# Altium schematic sheet 04_EBI_MEMORY.SchDoc
size 420 x 297 mm
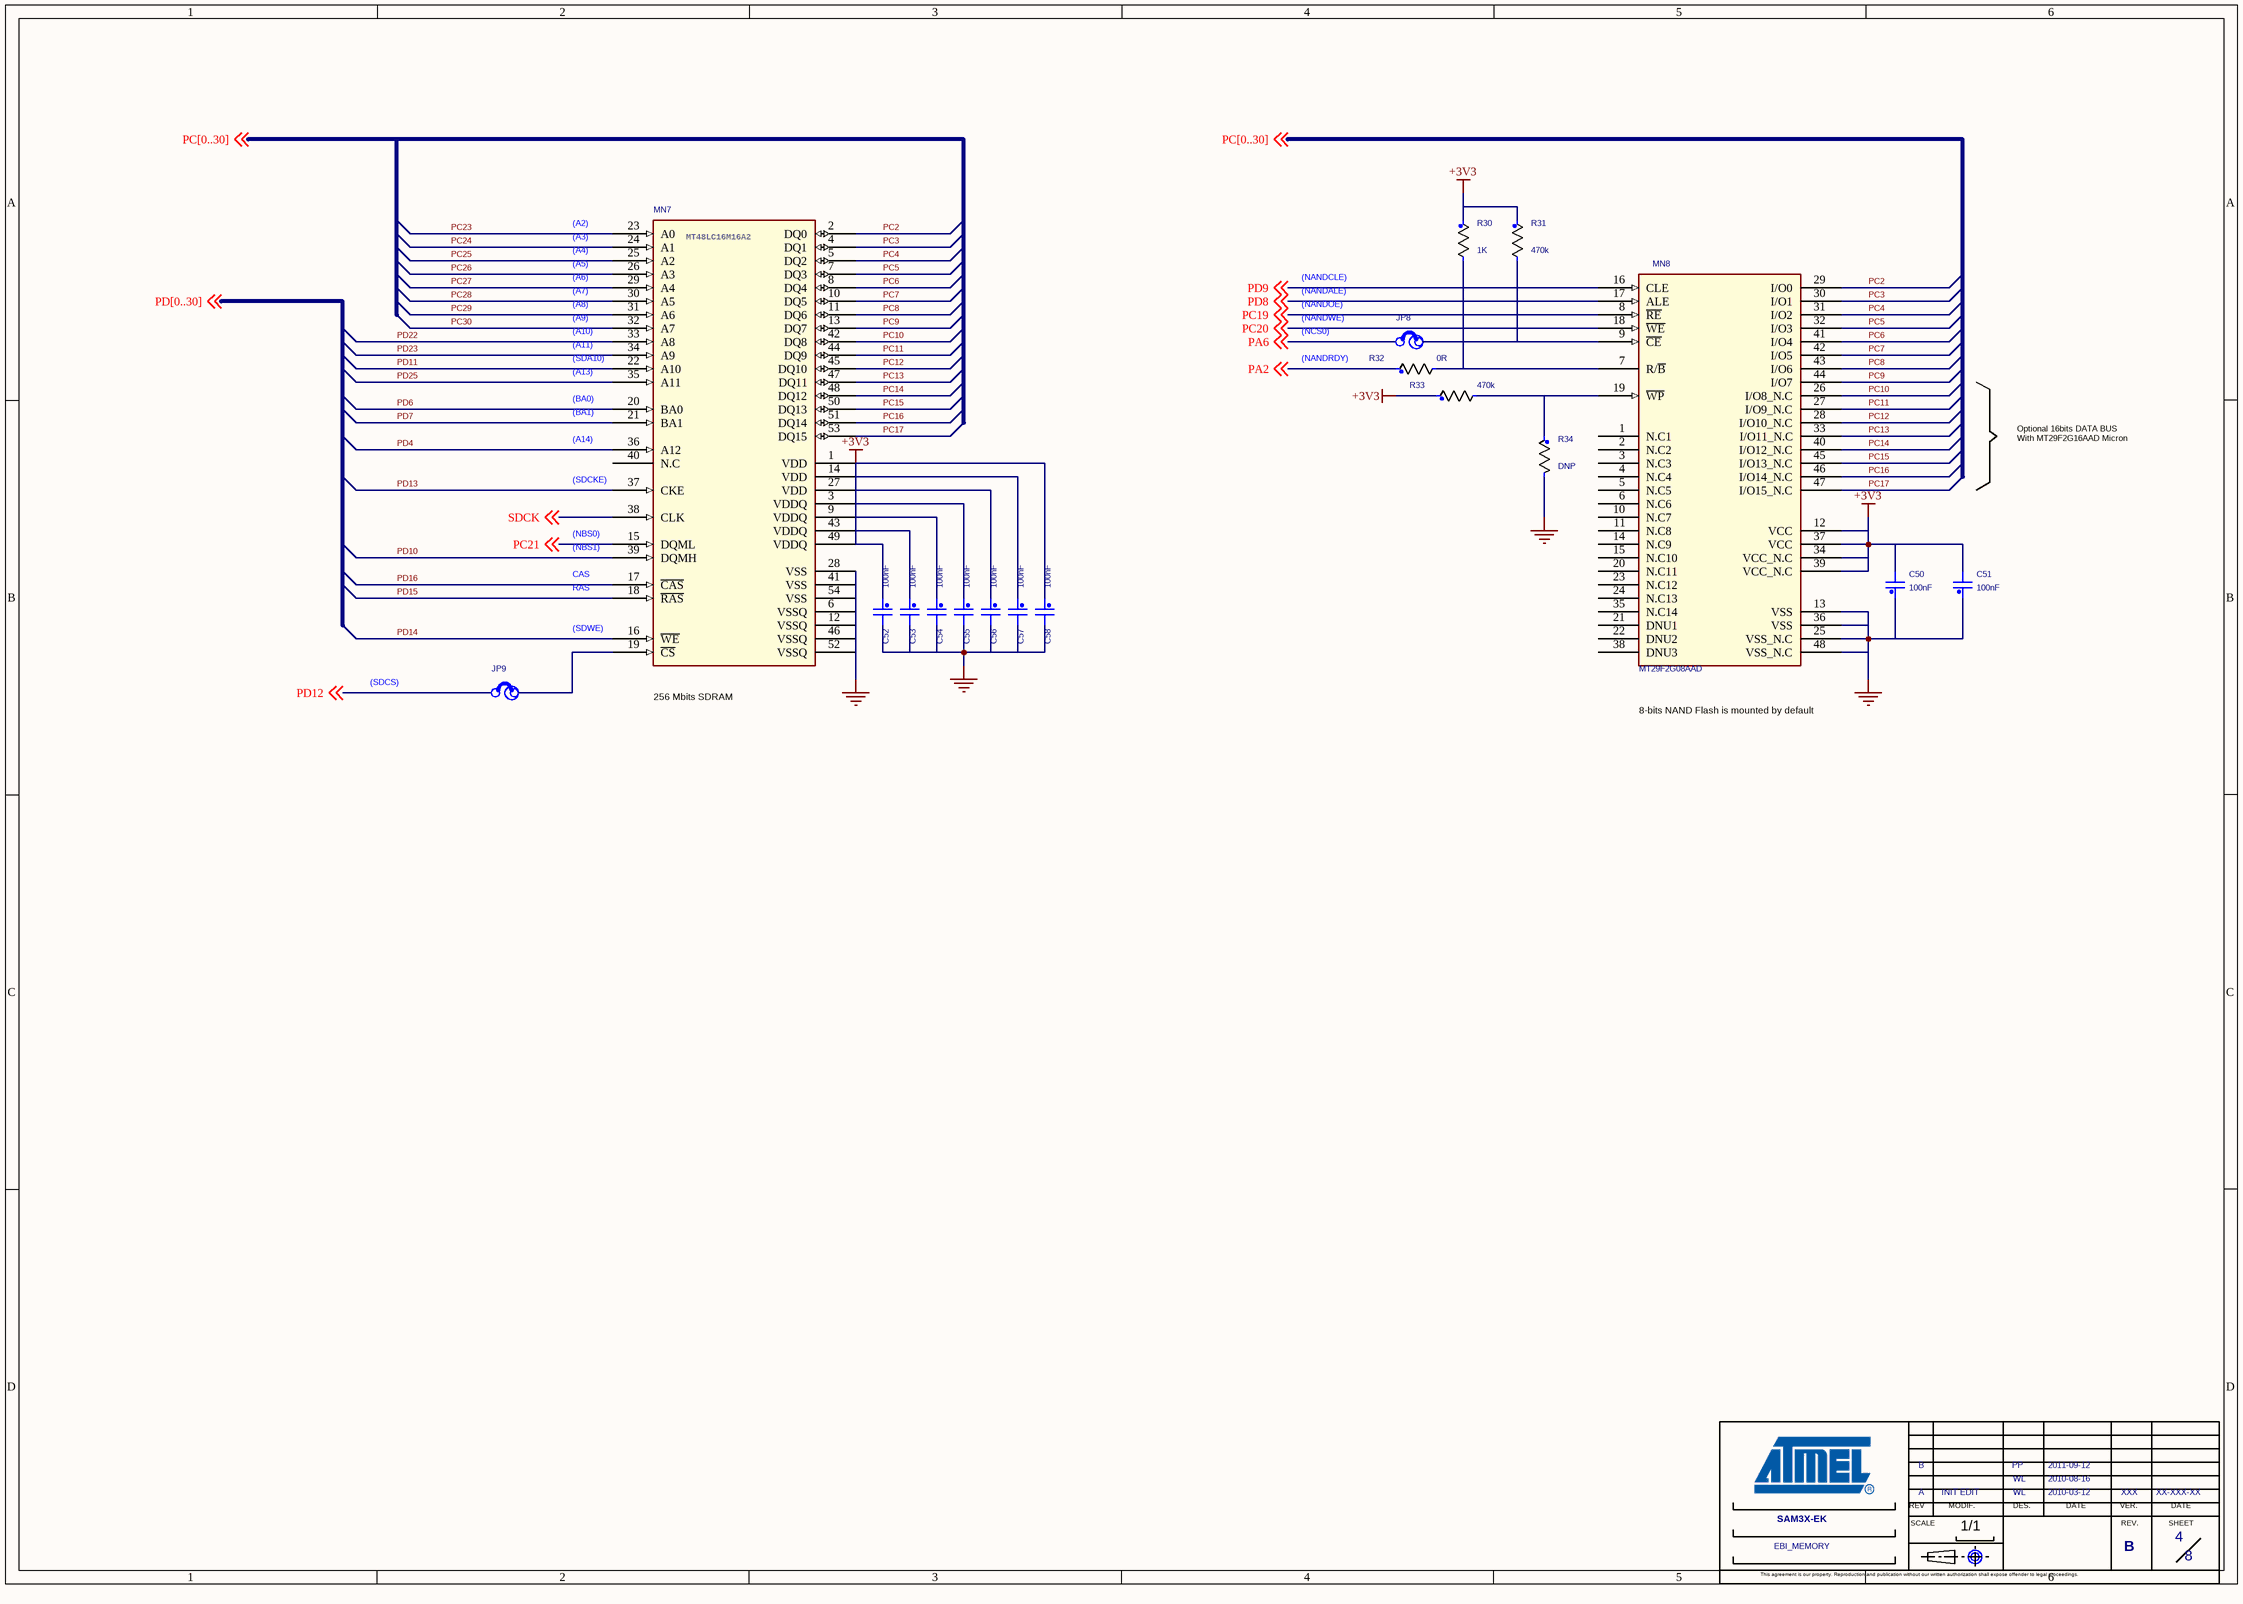
[diagram p0: 04_EBI_MEMORY.SchDoc]

## Parts
*  SHEET NAME 1: EBI_MEMORY  REV C: B  VERIF A: XXX  VERIF DATE A: XX-XXX-XX  Page Count: 8  Page Number: 4  DATE A: 2010-03-12  DATE B: 2010-08-16  DATE C: 2011-09-12  DES A: WL  DES C: PP  BOARD NAME: SAM3X-EK  VERSION: A  MODIF. DESCRIBE: INIT EDIT  (hidden comment: ATMEL ARM)  (graphical)
C50  100nF  [CAP0805]
C51  100nF  [CAP0805]
C52  100nF  [CAP0805]
C53  100nF  [CAP0805]
C54  100nF  [CAP0805]
C55  100nF  [CAP0805]
C56  100nF  [CAP0805]
C57  100nF  [CAP0805]
C58  100nF  [CAP0805]
JP8  JP  [BAR2PTS02]  (value not drawn)
JP9  JP  [BAR2PTS02]  (value not drawn)
MN7  MT48LC8M16A2TG-75  [TSOP54_01]  (value not drawn)
MN8  MT29F2G08AAD  [TSOP48]
R30  1K  [r0603]
R31  470k  [R0603]
R32  0R  [R0603]
R33  470k  [R0603]
R34  DNP  [R0603]
SH14  Jumper Pitch 2.54  [JUMPER-2.54]  (value not drawn)
SH15  Jumper Pitch 2.54  [JUMPER-2.54]  (value not drawn)

## Nets
+3V3: C50.2 C51.2 C52.1 C53.1 C54.1 C55.1 C56.1 C57.1 C58.1 MN7.1(VDD) MN7.3(VDDQ) MN7.9(VDDQ) MN7.14(VDD) MN7.27(VDD) MN7.43(VDDQ) MN7.49(VDDQ) MN8.12(VCC) MN8.34(VCC_N.C) MN8.37(VCC) MN8.39(VCC_N.C) R30.1 R31.1 R33.1
GND_POWER: C50.1 C51.1 C52.2 C53.2 C54.2 C55.2 C56.2 C57.2 C58.2 MN7.6(VSSQ) MN7.12(VSSQ) MN7.28(VSS) MN7.41(VSS) MN7.46(VSSQ) MN7.52(VSSQ) MN7.54(VSS) MN8.13(VSS) MN8.25(VSS_N.C) MN8.36(VSS) MN8.48(VSS_N.C) R34.2
PA2: R32.1 ; off-sheet PA2
PA6: JP8.2 ; off-sheet PA6
PC2: MN7.2(DQ0) MN8.29(I/O0)
PC3: MN7.4(DQ1) MN8.30(I/O1)
PC4: MN7.5(DQ2) MN8.31(I/O2)
PC5: MN7.7(DQ3) MN8.32(I/O3)
PC6: MN7.8(DQ4) MN8.41(I/O4)
PC7: MN7.10(DQ5) MN8.42(I/O5)
PC8: MN7.11(DQ6) MN8.43(I/O6)
PC9: MN7.13(DQ7) MN8.44(I/O7)
PC10: MN7.42(DQ8) MN8.26(I/O8_N.C)
PC11: MN7.44(DQ9) MN8.27(I/O9_N.C)
PC12: MN7.45(DQ10) MN8.28(I/O10_N.C)
PC13: MN7.47(DQ11) MN8.33(I/O11_N.C)
PC14: MN7.48(DQ12) MN8.40(I/O12_N.C)
PC15: MN7.50(DQ13) MN8.45(I/O13_N.C)
PC16: MN7.51(DQ14) MN8.46(I/O14_N.C)
PC17: MN7.53(DQ15) MN8.47(I/O15_N.C)
PC19: MN8.8(~{RE}) ; off-sheet PC19
PC20: MN8.18(~{WE}) ; off-sheet PC20
PC21: MN7.15(DQML) ; off-sheet PC21
PC23: MN7.23(A0)
PC24: MN7.24(A1)
PC25: MN7.25(A2)
PC26: MN7.26(A3)
PC27: MN7.29(A4)
PC28: MN7.30(A5)
PC29: MN7.31(A6)
PC30: MN7.32(A7)
PD4: MN7.36(A12)
PD6: MN7.20(BA0)
PD7: MN7.21(BA1)
PD8: MN8.17(ALE) ; off-sheet PD8
PD9: MN8.16(CLE) ; off-sheet PD9
PD10: MN7.39(DQMH)
PD11: MN7.22(A10)
PD12: JP9.2 ; off-sheet PD12
PD13: MN7.37(CKE)
PD14: MN7.16(~{WE})
PD15: MN7.18(~{RAS})
PD16: MN7.17(~{CAS})
PD22: MN7.33(A8)
PD23: MN7.34(A9)
PD25: MN7.35(A11)
SDCK: MN7.38(CLK) ; off-sheet SDCK
NetJP8_1: JP8.1 MN8.9(~{CE}) R31.2
NetJP9_1: JP9.1 MN7.19(~{CS})
NetMN8_7: MN8.7(R/~{B}) R30.2 R32.2
NetMN8_19: MN8.19(~{WP}) R33.2 R34.1

Not connected (* = marked no-connect by the designer): MN7 40(N.C); MN8 1(N.C1) 2(N.C2) 3(N.C3) 4(N.C4) 5(N.C5) 6(N.C6) 10(N.C7) 11(N.C8) 14(N.C9) 15(N.C10) 20(N.C11) 21(DNU1) 22(DNU2) 23(N.C12) 24(N.C13) 35(N.C14) 38(DNU3)

## Notes on the sheet
- (A2)
- (A3)
- (A4)
- (A5)
- (A6)
- (A7)
- (A8)
- (A9)
- (NANDALE)
- (NANDCLE)
- (NANDWE)
- (NANDOE)
- (near MN7) (SDA10)
- (A10)
- (A11)
- (A13)
- (NCS0)
- (NANDRDY)
- (A14)
- (BA0)
- (BA1)
- Optional 16bits DATA BUS
  With MT29F2G16AAD Micron
- (near MN7) (SDCKE)
- (NBS0)
- (NBS1)
- CAS
- RAS
- (SDWE)
- (SDCS)
- (near MN7) 256 Mbits SDRAM
- 8-bits NAND Flash is mounted by default
- (in symbol ATMEL ARM) REV; MODIF.; DES.; DATE; VER.; SCALE; REV.; SHEET; 1/1; This agreement is our property. Reproduction and publication without our written authorization shall expose offender to legal proceedings.
- (in symbol MT48LC16M16A2TG) MT48LC16M16A2

## Library data of the parts
* = ATMEL ARM: REV D: D; REV F: F; REV E: E; REV B: B; VERIF F: XXX; VERIF E: XXX; VERIF D: XXX; VERIF C: XXX; VERIF B: XXX; VERIF DATE F: XX-XXX-XX; VERIF DATE E: XX-XXX-XX; VERIF DATE D: XX-XXX-XX; VERIF DATE C: XX-XXX-XX; REV: B; VERIF DATE B: XX-XXX-XX; FT: ?; Page Size: A; Page Create Date: june 19, 2004; DATE D: XX-XXX-XX; DATE E: XX-XXX-XX; DATE F: XX-XXX-XX; DES E: XXX; DES F: XXX; DES B: WL; DES D: XXX
C50 C51 = C_Generic: Toler.: 10%; P/N #1: C0603C104K4RAC; Voltage: 16V; Mfg #1: KEMET; Dielectric: X7R; REF: C1608X7R1C104KT; FAB: TDK; DEV: C0603; DESIG: Ceramic Capacitor; BOI: 0603; TOL: 10%; TEN: 16V; VAL: 100nF
C52-C58 = C_Generic: Toler.: 10%; P/N #1: C0603C104K4RAC; Voltage: 16V; Mfg #1: KEMET; Dielectric: X7R; BOI: 0603; DESIG: Ceramic Capacitor; DEV: C0603; FAB: TDK; REF: C1608X7R1C104KT; VAL: 100nF; TEN: 16V; TOL: 10%
JP8 JP9 = JUMP_0: DESIG: 2.54mm Pin Header,Single Row,Straight/Right Angle(2pin); FAB: SHENZHEN SITUO; REF: 045; VAL: 045
MN7 = MT48LC16M16A2TG: VAL: MT48LC16M16A2TG-75; DESIG: SDRAM 4M x 16 x 4; BOI: TSOP54; FAB: MICRON; ID: ATLFIC017; REF: MT48LC16M16A2TG-75; DEV: TSOP54_01
MN8 = MT29F2GxxAAD: DEV: CIS_TSOP48_01; FAB: Micron; DESIG: NANDFLASH; TEN: 2,7..3,6V; RoHS: YES; BOI: TSOP48
R30 = R_Generic: P/N #1: CR10-1001F-T; BOI: 0603; DESIG: RC21 5%; FAB: YAGEO; REF: RC0603JR-071KL; TOL: 5%; DEV: R0603; VAL: 1K
R31 R33 = R_Generic: P/N #1: CR10-1001F-T; TOL: 5%; REF: RC0603JR-07470KL; FAB: YAGEO; DESIG: RC21 5%; BOI: 0603; VAL: 470K; DEV: R0603
R32 = R_Generic: P/N #1: CR10-1001F-T; BOI: 0603; DESIG: RC21 5%; FAB: YAGEO; REF: RC0603JR-070RL; TOL: 5%; DEV: R0603; VAL: 0R
R34 = R_Generic: P/N #1: CR10-1001F-T; BOI: 0603; DESIG: RC21 5%; FAB: YAGEO; VAL: NOT POPULATED; TOL: 5%; DEV: R0603
SH14 SH15 = JUMPER-2.54: Jumper,2 Points Jumper Pitch 2.54; Part Number: 440-00002-1; Manufacturer: WIESON; Manufacturer Part Number: G4160-1A60BF1U; FAB: NA; REF: JUMPER 2.54; DESIG: 2 POINTS JUMPER PITCH 2.54; VAL: JUMPER 2.54; BOI: NA; Part Type: Jumper